# EAGLE design ZIntermediar2024 (EAGLE 6.5.0)
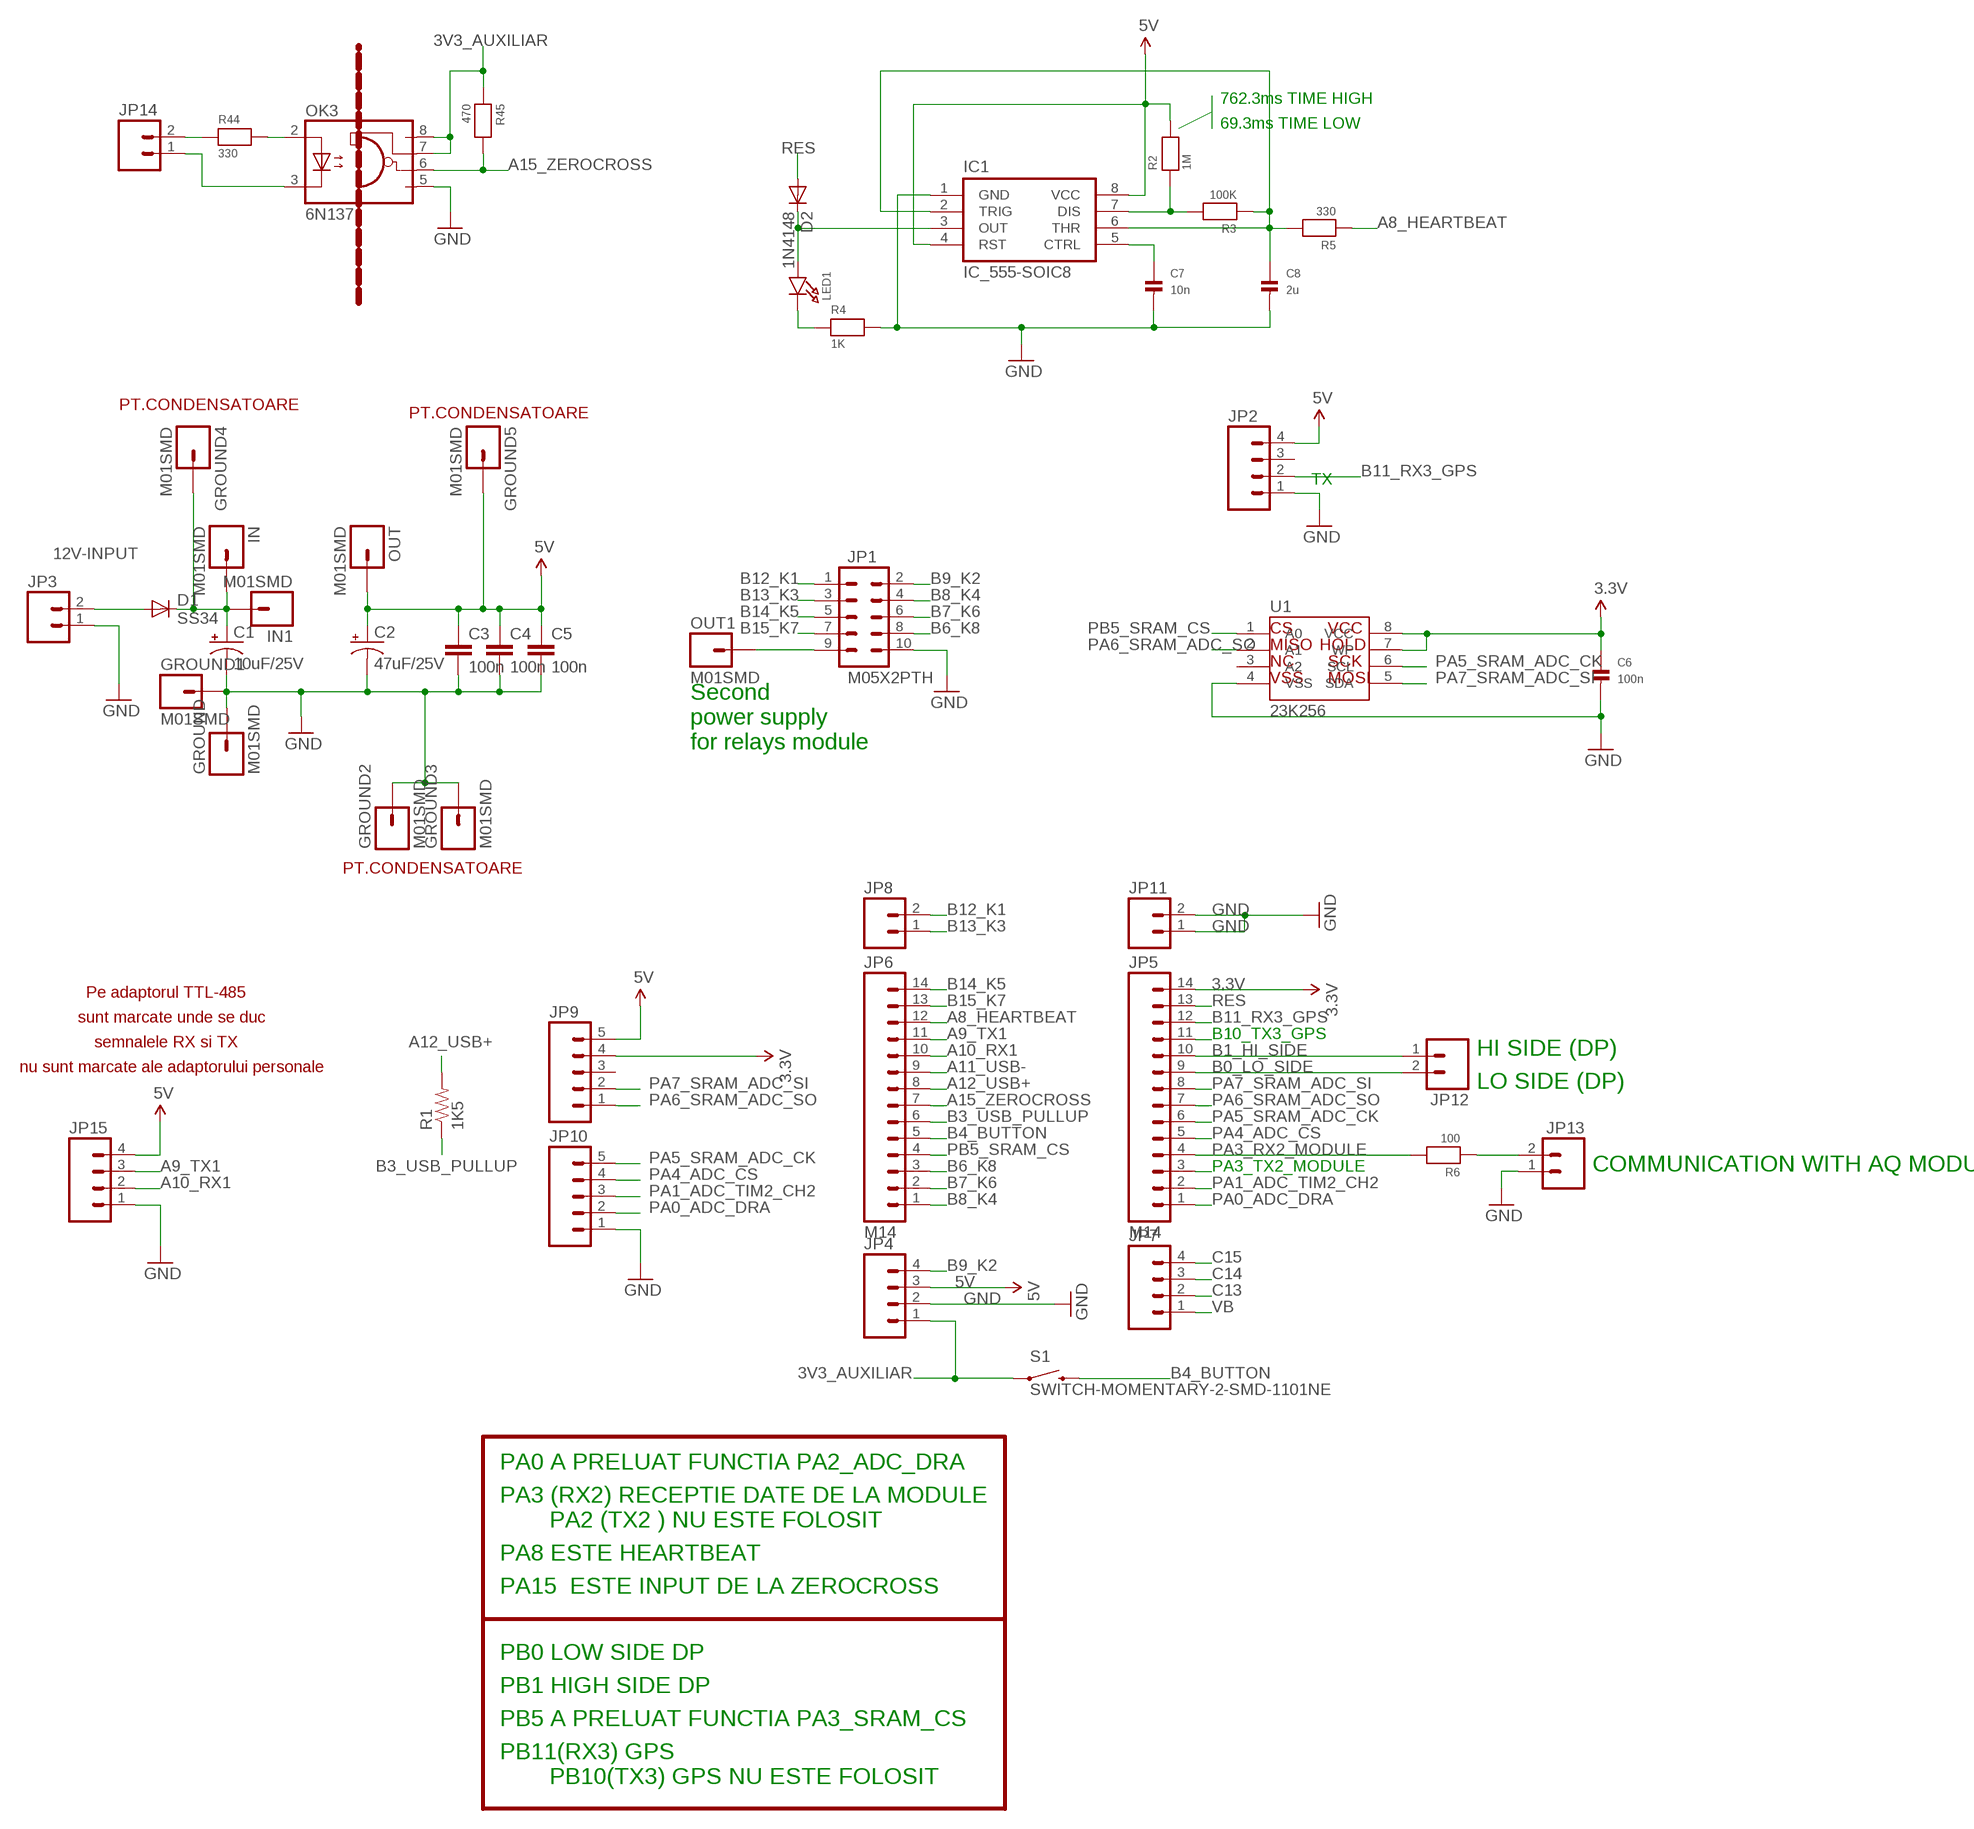
[diagram p0: schematic, sheet 1]

## Parts
C1  10uF/25V  CAP_POLE  [PANASONIC_E]
C2  47uF/25V  CAP_POLE  [PANASONIC_E]
C3  100n  CAP1206  [1206]
C4  100n  CAP1206  [1206]
C5  100n  CAP1206  [1206]
C6  100n  CAP_CERAMIC_0805MP  [_0805MP]
C7  10n  CAP_CERAMIC_0805MP  [_0805MP]
C8  2u  CAP_CERAMIC1206  [1206]
D1  SS34  DIODE-SMC  [SMC]
D2  1N4148  DIODE-MINIMELF  [MINIMELF]
GROUND  M01SMD  [LUXEON-PAD]
GROUND1  M01SMD  [LUXEON-PAD]
GROUND2  M01SMD  [LUXEON-PAD]
GROUND3  M01SMD  [LUXEON-PAD]
GROUND4  M01SMD  [LUXEON-PAD]
GROUND5  M01SMD  [LUXEON-PAD]
IC1  IC_555-SOIC8  [SOIC-8]
IN  M01SMD  [LUXEON-PAD]
IN1  M01SMD  [LUXEON-PAD]
JP1  M05X2PTH  [AVR_ICSP]
JP2  M04PTH  [1X04]
JP3  M025MM  [SCREWTERMINAL-5MM-2]
JP4  M04PTH  [1X04]
JP5  M14  [1X14]
JP6  M14  [1X14]
JP7  M04PTH  [1X04]
JP8  M02PTH  [1X02]
JP9  M05PTH_LONGPADS  [1X05_LONGPADS]
JP10  M05PTH_LONGPADS  [1X05_LONGPADS]
JP11  M02PTH  [1X02]
JP12  M025MM  [SCREWTERMINAL-5MM-2]
JP13  M025MM  [SCREWTERMINAL-5MM-2]
JP14  M025MM  [SCREWTERMINAL-5MM-2]
JP15  M04LONGPADS  [1X04_LONGPADS]
LED1  LED0805  [CHIPLED_0805]
OK3  6N137  [DIL08]
OUT  M01SMD  [LUXEON-PAD]
OUT1  M01SMD  [LUXEON-PAD]
R1  1K5  RESISTOR1206  [1206]
R2  1M  RESISTOR_0805MP  [_0805MP]
R3  100K  RESISTOR_0805MP  [_0805MP]
R4  1K  RESISTOR_0805MP  [_0805MP]
R5  330  RESISTOR_0805MP  [_0805MP]
R6  100  RESISTOR_0805MP  [_0805MP]
R44  330  RESISTOR_0805MP  [_0805MP]
R45  470  RESISTOR_0805MP  [_0805MP]
S1  SWITCH-MOMENTARY-2-SMD-1101NE  [TACTILE-SWITCH-1101NE]
U1  23K256  EEPROM-I2CSMD  [SO08]

## Nets
3.3V: C6.1 JP5.14 JP9.4 U1.7(WP) U1.8(VCC)
3V3_AUXILIAR: JP4.1 OK3.7(VE) OK3.8(VCC) R45.1 S1.P$1
5V: C2.+ C3.1 C4.1 C5.1 GROUND5.P$1 IC1.4(RST) IC1.8(VCC) JP2.4 JP4.3 JP9.5 JP15.4 OUT.P$1 R2.2
12V-INPUT: C1.+ D1.C GROUND4.P$1 IN1.P$1 IN.P$1
A8_HEARTBEAT: JP6.12 R5.1
A9_TX1: JP6.11 JP15.3
A10_RX1: JP6.10 JP15.2
A11_USB-: JP6.9
A12_USB+: JP6.8 R1.2
A15_ZEROCROSS: JP6.7 OK3.6(VO) R45.2
B0_LO_SIDE: JP5.9 JP12.2
B1_HI_SIDE: JP5.10 JP12.1
B3_USB_PULLUP: JP6.6 R1.1
B4_BUTTON: JP6.5 S1.P$2
B6_K8: JP1.8 JP6.3
B7_K6: JP1.6 JP6.2
B8_K4: JP1.4 JP6.1
B9_K2: JP1.2 JP4.4
B11_RX3_GPS: JP2.2 JP5.12
B12_K1: JP1.1 JP8.2
B13_K3: JP1.3 JP8.1
B14_K5: JP1.5 JP6.14
B15_K7: JP1.7 JP6.13
C13: JP7.2
C14: JP7.3
C15: JP7.4
CTRL: C7.1 IC1.5(CTRL)
GND: C1.- C2.- C3.2 C4.2 C5.2 C6.2 C7.2 C8.2 GROUND1.P$1 GROUND2.P$1 GROUND3.P$1 GROUND.P$1 IC1.1(GND) JP1.10 JP2.1 JP3.1 JP4.2 JP10.1 JP11.1 JP11.2 JP13.1 JP15.1 OK3.5(GND) R4.2 U1.4(VSS)
IMPULSE: JP14.2 R44.1
N$1: D2.C IC1.3(OUT) LED1.A
N$2: LED1.C R4.1
N$3: JP1.9 OUT1.P$1
N$4: JP14.1 OK3.3(C)
N$5: JP5.11
N$6: C8.1 IC1.2(TRIG) IC1.6(THR) R3.1 R5.2
N$7: D1.A JP3.2
N$8: IC1.7(DIS) R2.1 R3.2
N$10: JP5.3
N$12: JP13.2 R6.1
N$53: OK3.2(A) R44.2
PA0_ADC_DRA: JP5.1 JP10.2
PA1_ADC_TIM2_CH2: JP5.2 JP10.3
PA3_RX2_MODULE: JP5.4 R6.2
PA4_ADC_CS: JP5.5 JP10.4
PA5_SRAM_ADC_CK: JP5.6 JP10.5 U1.6(SCL)
PA6_SRAM_ADC_SO: JP5.7 JP9.1 U1.2(A1)
PA7_SRAM_ADC_SI: JP5.8 JP9.2 U1.5(SDA)
PB5_SRAM_CS: JP6.4 U1.1(A0)
RES: D2.A JP5.13
VB: JP7.1
Unconnected: JP2.3 JP9.3 U1.3(A2)

## Notes on the sheet
- 762.3ms TIME HIGH
- 69.3ms TIME LOW
- PT.CONDENSATOARE
- PT.CONDENSATOARE
- TX
- CS | VCC
- MISO | HOLD
- NC | SCK
- VSS | MOSI
- Second
- power supply
- for relays module
- PT.CONDENSATOARE
- Pe adaptorul TTL-485
- sunt marcate unde se duc
- B10_TX3_GPS
- semnalele RX si TX
- HI SIDE (DP)
- nu sunt marcate ale adaptorului personale
- LO SIDE (DP)
- PA3_TX2_MODULE | COMMUNICATION WITH AQ MODULE
- PA0 A PRELUAT FUNCTIA PA2_ADC_DRA
- PA3 (RX2) RECEPTIE DATE DE LA MODULE
- PA2 (TX2 ) NU ESTE FOLOSIT
- PA8 ESTE HEARTBEAT
- PA15  ESTE INPUT DE LA ZEROCROSS
- PB0 LOW SIDE DP
- PB1 HIGH SIDE DP
- PB5 A PRELUAT FUNCTIA PA3_SRAM_CS
- PB11(RX3) GPS
- PB10(TX3) GPS NU ESTE FOLOSIT

## Library data of the parts
C1 C2 = SparkFun-Passives:CAP_POL: Capacitor Polarized These are standard SMD and PTH capacitors. Normally 10uF, 47uF, and 100uF in electrolytic and tantalum varieties. Always verify the external diameter of the through hole cap, it varies with capacity, voltage, and manufacturer. The EIA devices should be standard.
C3-C5 = SparkFun-Passives:CAP: Capacitor Standard 0603 ceramic capacitor, and 0.1" leaded capacitor.
C6-C8 = microbuilder:CAP_CERAMIC: Ceramic Capacitors 0402 - 0402 Surface Mount Capacitors 16pF 50V 5% [Digikey: 445-4899-2-ND] 18pF 50V 5% [Digikey: 490-1281-2-ND] 22pF 50V 5% [Digikey: 490-1283-2-ND] 68pF 50V 5% [Digikey: 490-1289-2-ND] 0.1uF 10V 10% [Digikey: 490-1318-2-ND] 1.0uF 6.3V 10% [Digikey: 490-1320-2-ND] 0603 - 0603 Surface Mount Capacitors 16 pF 50V 5% [Digikey: 445-5051-2-ND] 22 pF 50V [Digikey: PCC220ACVTR-ND] 33 pF 50V 5% [Digikey: 490-1415-1-ND] 56pF 50V 5% [Digikey: 490-1421-1-ND] 220pF 50V 5% [Digikey: 445-1285-1-ND] 680 pF 50V 2200 pF 50V 5% C0G [Digikey: 445-1297-1-ND] 5600 pF 100V 5% X7R [Digikey: 478-3711-1-ND] 0.1 µF 25V 10% [Digikey: PCC2277TR-ND] 0.22 µF 16V 10% X7R [Digikey: 445-1318-1-ND] 1.0 µF 25V 10% [Digikey: 445-5146-2-ND] 0603 - RF Specific 3pF 250V +/-0.1pF RF [Digikey: 712-1347-1-ND] 18 pF 250V 5% [Digikey: 478-3505-1-ND or 712-1322-1-ND] 56 pF 250V 5% C0G RF [Digikey: 490-4867-1-ND] 68 pF 250V RF [Digikey: 490-4868-1-ND] 0805 - 0805 Surface Mount Capacitors 220 pF 250V 2% RF Ceramic Capacitor [Digikey: 712-1398-1-ND] 1000 pF 50V 2% NP0 Ceramic Capacitor [Digikey: 478-3760-1-ND] 0.1 µF 25V 10% Ceramic Capacitor [Digikey: PCC1828TR-ND] 1.0 µF 16V 10% Ceramic Capacitor[Digikey: 490-1691-2-ND] 10.0 µF 10V 10% Ceramic Capacitor[Digikey: 709-1228-1-ND] 10.0 uF 16V 10% Ceramic Capacitor [Digikey: 478-5165-2-ND] 47 uF 6.3V 20% Ceramic Capacitor [Digikey: 587-1779-1-ND or 399-5506-1-ND] 1206 - 1206 Surface Mount Capacitors 47uF 10V 20% Ceramic Capacitor [Digikey: 490-5528-1-ND or 399-5508-1-ND or 445-6010-1-ND] 100uF 6.3V -20%, +80% Y5V Ceramic Capacitor (Digikey: 490-4512-1-ND, Mouser: 81-GRM31CF50J107ZE1L)
D1 D2 = diode:DIODE-: DIODE
GROUND GROUND1-GROUND5 IN IN1 OUT OUT1 = SparkFun-Connectors:M01: Header 1 Standard 1-pin 0.1" header. Use with straight break away headers (SKU : PRT-00116), right angle break away headers (PRT-00553), swiss pins (PRT-00743), machine pins (PRT-00117), and female headers (PRT-00115).
IC1 = dp_devices:IC_555: Classic 555 IC
JP1 = SparkFun-Connectors:M05X2: Header 5x2 Standard 10-pin dual row 0.1" header. Commonly used with AVR-ISP. Use with Spark Fun Electronics SKU: PRT-00778
JP2 JP4 JP7 JP15 = SparkFun-Connectors:M04: Header 4 Standard 4-pin 0.1" header. Use with straight break away headers (SKU : PRT-00116), right angle break away headers (PRT-00553), swiss pins (PRT-00743), machine pins (PRT-00117), and female headers (PRT-00115). Molex polarized connector foot print use with SKU : PRT-08231 with associated crimp pins and housings. 1MM SMD Version SKU: PRT-10208
JP3 JP8 JP11-JP14 = SparkFun-Connectors:M02: Header 2 Standard 2-pin 0.1" header. Use with straight break away headers (SKU : PRT-00116), right angle break away headers (PRT-00553), swiss pins (PRT-00743), machine pins (PRT-00117), and female headers (PRT-00115). Molex polarized connector foot print use with SKU : PRT-08233 with associated crimp pins and housings.
JP5 JP6 = SparkFun-Connectors:M14: Header 14 Standard 14-pin 0.1" header. Use with straight break away headers (SKU : PRT-00116), right angle break away headers (PRT-00553), swiss pins (PRT-00743), machine pins (PRT-00117), and female headers (PRT-00115).
JP9 JP10 = SparkFun-Connectors:M05: Header 5 Standard 5-pin 0.1" header. Use with straight break away headers (SKU : PRT-00116), right angle break away headers (PRT-00553), swiss pins (PRT-00743), machine pins (PRT-00117), and female headers (PRT-00115). Molex polarized connector foot print use with SKU : PRT-08230 with associated crimp pins and housings.
LED1 = microbuilder:LED: LED 0603 - 0603 Surface Mount Package 2mA: Green LED - Low Power (3.9mcd, 2ma, 1.7Vf) - Digikey: 475-2709-2-ND Orange LED - Low Power (9.8mcd, 2ma, 1.8Vf) - Digikey: 475-1194-2-ND Red LED - Low Power (5mcd, 2ma, 1.8Vf) - Digikey: 475-1195-2-ND Yellow LED - Low Power (7mcd, 2ma, 1.8Vf) - Digikey: 475-1196-2-ND 5mA: Blue LED - Low Power (17mcd, 5ma, 2.9Vf) - Digikey: LNJ937W8CRACT-ND 0805 - 0805 Surface Mount Package 2mA: Red LED (8.8mcd, 2mA, 1.8Vf, Clear) - Low Power [Digikey: 475-2510-1-ND] Green LED (5mcd, 2mA, 1.8Vf, Clear) - Low Power [Digikey: 475-2730-1-ND] Yellow LED (11.3mcd, 2mA, 1.8Vf, Clear) - Low Power [Digikey: 475-2555-1-ND] 20mA: Red LED (104mcd, 20mA, Diffused) - LS R976 [Digikey: 475-1278-6-ND] Red LED (12mcd, 20mA, 2.0Vf, Clear) - APT2012EC [Digikey: 754-1128-1-ND] Green LED (15mcd, 20mA, 2.2Vf, Clear) - APT2012GC [Digikey: 754-1131-1-ND] Orange LED (160mcd, 20mA, 2.1Vf, Clear) - APT2012SECK [Digikey: 754-1130-1-ND] 1206 - 1206 Surface Mount Package Green LED (26mcd, 20mA, Diffused) - LG N971 [Digikey: 475-1407-6-ND] Red LED (15mcd, 20mA, Diffused) - LH N974 [Digikey: 475-1416-6-ND] Cree - Cree High-Power Surface Mount LEDs XPEBWT-L1-0000-00D50 - White 111lm 350mA 2.9Vf 6200K 110° XTEAWT-00-0000-00000LEE3 - White 114lm 350mA 2.85Vf 5000K 115° Everlight - Everlight 45-21 Series Surface Mount LEDs 45-21/QK2C-B2832AC2CB2/2T - Warm White 2000mcd 20mA 3.25Vf 3050K 120° 45-21/LK2C-B38452C4CB2/2T - Nuetral White 2000mcd 20mA 3.25Vf 4150K 120° 45-21/LK2C-B50634C6CB2/2T - Cold White 2200mcd 20mA 3.25Vf 5650K 120° PLCC2 Reverse Mount LS T77K-J1L2-1-0-2-R18-Z - Red 11.25mcd 2mA 1.8Vf 630nm 120° LO T77K-L1M2-24-Z - Orange 19.6mcd 2mA 1.8Vf 606nm 120° LY T77K-K2M1-26-Z - Yellow 15.7mcd 2mA 1.8Vf 587nm 120°
OK3 = optocoupler:6N137: MOTOROLA OPTO COUPLER; MPN: 6N137; OC_FARNELL: 1328376; OC_NEWARK: 52M1895
R1 = SparkFun-Passives:RESISTOR: Resistor Basic schematic elements and footprints for 0603, 1206, and PTH resistors.
R2-R6 R44 R45 = microbuilder:RESISTOR: Resistors 0402 - 0402 Surface Mount Package 22 Ohm 1% 1/16W [Digikey: 311-22.0LRTR-ND] 33 Ohm 5% 1/16W 1.0K 5% 1/16W 1.5K 5% 1/16W 2.0K 1% 1/16W 10.0K 1% 1/16W [Digikey: 311-10.0KLRTR-ND] 10.0K 5% 1/16W [Digikey: RMCF0402JT10K0TR-ND] 12.1K 1% 1/16W [Digikey: 311-22.0LRTR-ND] 100.0K 5% 1/16W 0603 - 0603 Surface Mount Package 0 Ohm 1/10 Watt 1% Resistor 15 Ohm 1/10 Watt 1% Resistor 33 Ohm 1/10 Watt 1% Resistor 49.9 Ohm 1/10 Watt 1% Resistor 100 Ohm 1/10 Watt 1% Resistor 150 Ohm 1/10 Watt 1% Resistor 240 Ohm 1/10 Watt 1% Resistor 390 Ohm 1/10 Watt 1% Resistor 560 Ohm 1/10 Watt 1% Resistor 680 Ohm 1/10 Watt 1% Resistor 750 Ohm 1/10 Watt 1% Resistor 1.0K Ohm 1/10 Watt 1% Resistor 1.5K Ohm 1/10 Watt 1% Resistor 2.0K Ohm 1/10 Watt 1% Resistor 2.2K Ohm 1/10 Watt 1% Resistor 3.3K Ohm 1/10 Watt 1% Resistor 4.7K Ohm 1/10 Watt 1% Resistor 10.0K Ohm 1/10 Watt 1% Resistor 12.0K Ohm 1/10 Watt 1% Resistor 12.1K Ohm 1/10 Watt 1% Resistor 20.0K Ohm 1/10 Watt 1% Resistor 33.0K Ohm 1/10 Watt 1% Resistor 100.0K Ohm 1/10 Watt 1% Resistor 0805 - 0805 Surface Mount Package 0 Ohm 1/8 Watt 1% Resistor 33 Ohm 1/8 Watt 1% Resistor 100 Ohm 1/8 Watt 1% Resistor 150 Ohm 1/8 Watt 1% Resistor 200 Ohm 1/8 Watt 1% Resistor 240 Ohm 1/8 Watt 1% Resistor 330 Ohm 1/8 Watt 1% Resistor 390 Ohm 1/8 Watt 1% Resistor 470 Ohm 1/8 Watt 1% Resistor 1.0K Ohm 1/8 Watt 1% Resistor 1.5K Ohm 1/8 Watt 1% Resistor 2.0K Ohm 1/8 Watt 1% Resistor 4.7K Ohm 1/8 Watt 1% Resistor 5.1K Ohm 1/8 Watt 1% Resistor 5.6K Ohm 1/8 Watt 1% Resistor 10.0K Ohm 1/8 Watt 1% Resistor 22.0K Ohm 1/8 Watt 1% Resistor 33.0K Ohm 1/8 Watt 1% Resistor 100K Ohm 1/8 Watt 1% Resistor 1206 - 1206 Surface Mount Package 2012 - 2010 Surface Mount Package 0.11 Ohm 1/2 Watt 1% Resistor - Digikey: RHM.11UCT-ND
S1 = SparkFun-Electromechanical:SWITCH-MOMENTARY-2: Various NO switches- pushbuttons, reed, etc
U1 = SparkFun-DigitalIC:EEPROM-I2C: I2C EEPROM chips, 24LC256 (and others)

## Board
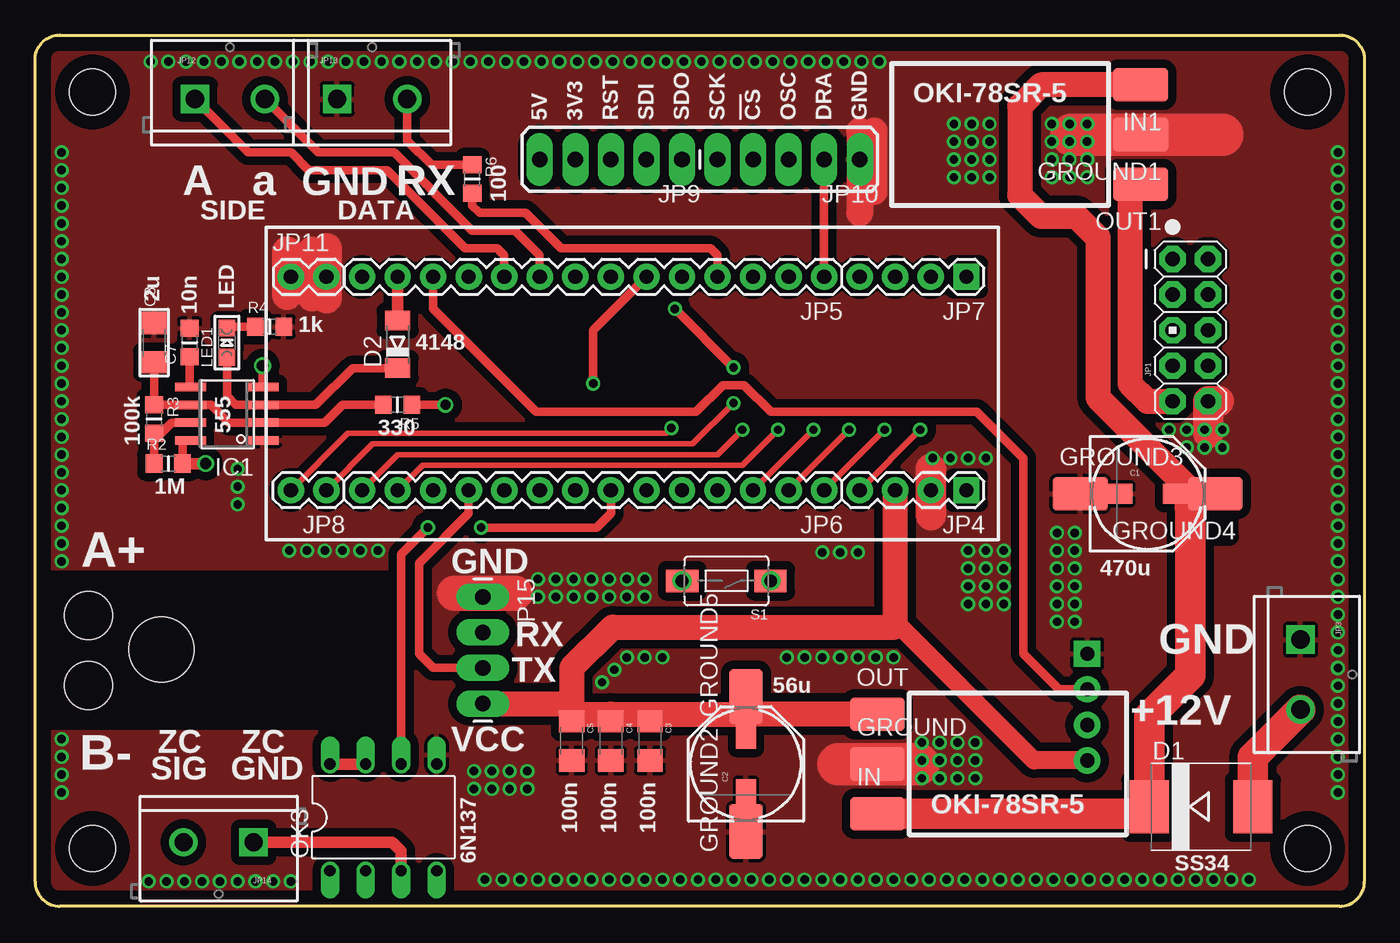
[diagram p1: board, top side]
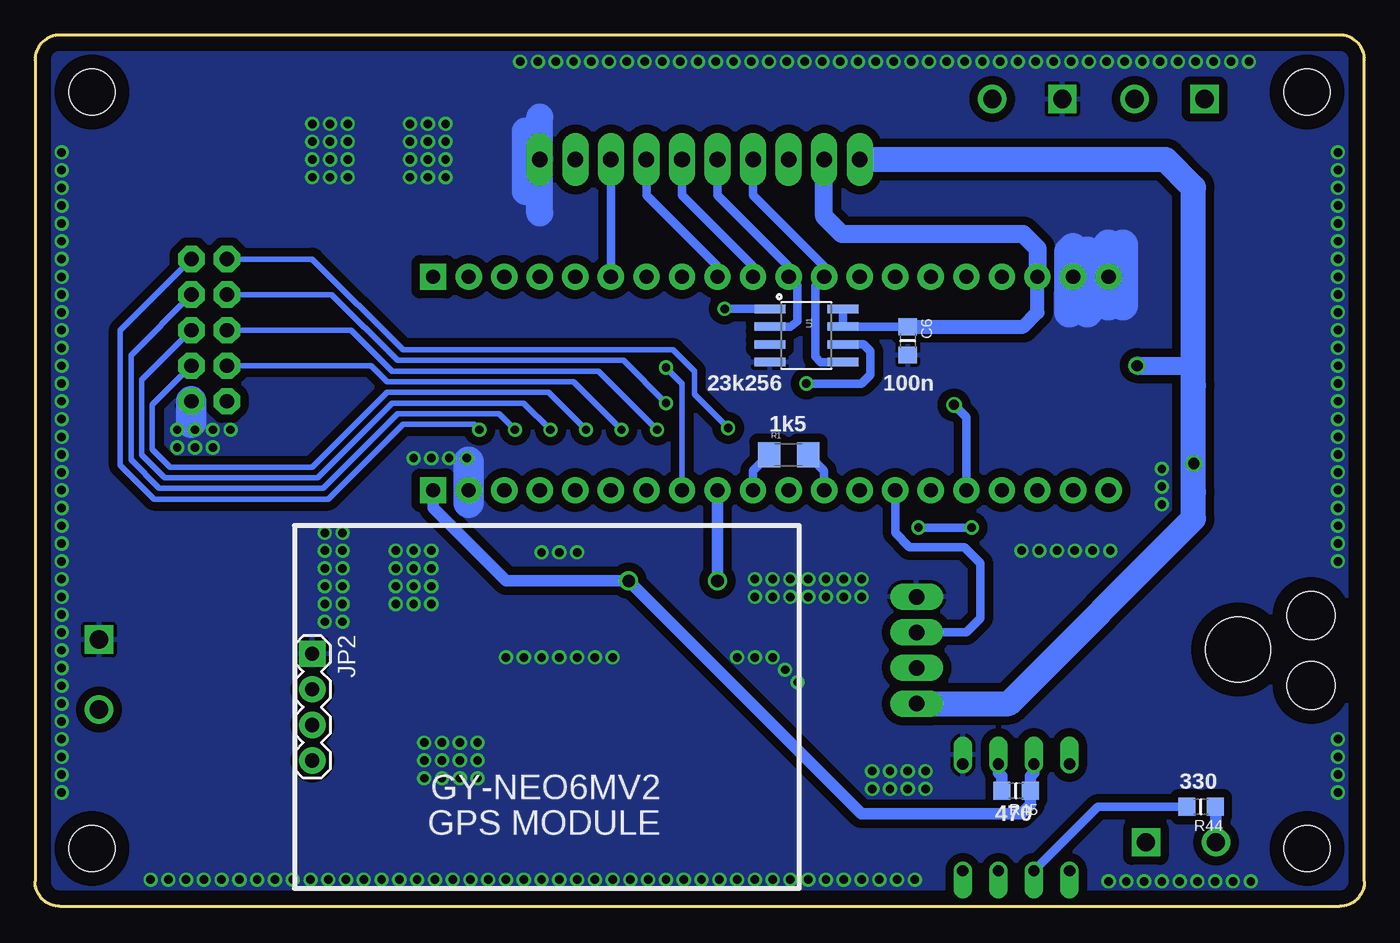
[diagram p2: board, bottom side, seen from below]

Size 95 x 62.23 mm. Coordinates in mm from the lower left corner, seen from the top.
Outline: 0,1.78 0,60.45 arc-90 1.78,62.23 93.22,62.23 arc-90 95,60.45 95,1.78 arc-90 93.22,0 1.78,0 arc-90 0,1.78
Copper layers (1*16): Top 0.035mm / dielectric 1.5mm / Bottom 0.035mm
Design rules "default *": minimum track width 10mil, minimum drill 24mil, track to track 8mil, track to pad 8mil, pad to pad 8mil, via to via 8mil, smd to smd 8mil, copper to edge 40mil, drill to drill 8mil, minimum pad ring 10mil, minimum via ring 8mil, stop-mask expansion 4mil, vias tented up to drill 24mil, thermal gap 10mil
Holes 3.43 mm at 3.84,20.78 3.84,15.77
Holes 4.65 mm at 9.04,18.34
tRestrict: area 84.4,26.4 to 85.4,27.7; area 0.9,13.2 to 26.3,23.4

### Footprints (pad centres in the part's own frame; a part is rotated, then mirrored left to right if it is on the bottom)
PANASONIC_E = smd 3.8 x 1.4: + 3,0; - -3,0
1206 = smd 1.6 x 1.8: 1 -1.4,0; 2 1.4,0
_0805MP = smd 1.2 x 1.3: 1 -1.016,0; 2 1.016,0
SMC = smd 2.8 x 3.8: A 3.7,0; C -3.7,0
MINIMELF = smd 1.4 x 1.8: A 1.7,0; C -1.7,0
LUXEON-PAD = smd 3.9 x 2.4: P$1 0,0
SOIC-8 = smd 0.6 x 2.2: 1 -1.905,-2.6; 2 -0.635,-2.6; 3 0.635,-2.6; 4 1.905,-2.6; 5 1.905,2.6; 6 0.635,2.6; 7 -0.635,2.6; 8 -1.905,2.6
AVR_ICSP = drill 1.016 pad 1.88 octagon: 1 -1.27,5.08; 2 1.27,5.08; 3 -1.27,2.54; 4 1.27,2.54; 5 -1.27,0; 6 1.27,0; 7 -1.27,-2.54; 8 1.27,-2.54; 9 -1.27,-5.08; 10 1.27,-5.08
1X04 = drill 1.016 pad 1.88 square: 1 0,0 | drill 1.016 pad 1.88: 2 2.54,0; 3 5.08,0; 4 7.62,0
SCREWTERMINAL-5MM-2 = drill 1.3 pad 2.032 square: 1 0,0 | drill 1.3 pad 2.032: 2 5,0
1X14 = drill 1.016 pad 1.88: 1 0,0; 2 2.54,0; 3 5.08,0; 4 7.62,0; 5 10.16,0; 6 12.7,0; 7 15.24,0; 8 17.78,0; 9 20.32,0; 10 22.86,0; 11 25.4,0; 12 27.94,0; 13 30.48,0; 14 33.02,0
1X02 = drill 1.016 pad 1.88: 1 0,0; 2 2.54,0
1X05_LONGPADS = drill 1.118 pad 1.88 long: 1 0,0; 2 2.54,0; 3 5.08,0; 4 7.62,0; 5 10.16,0
1X04_LONGPADS = drill 1.118 pad 1.88 long: 1 0,0; 2 2.54,0; 3 5.08,0; 4 7.62,0
CHIPLED_0805 = smd 1.2 x 1.2: A 0,-1.05; C 0,1.05
DIL08 = drill 0.813 offset: 1 -3.81,-3.81; 2 -1.27,-3.81; 3 1.27,-3.81; 4 3.81,-3.81; 5 3.81,3.81; 6 1.27,3.81; 7 -1.27,3.81; 8 -3.81,3.81
TACTILE-SWITCH-1101NE = smd 2.3 x 1.6: P$1 -3.15,0; P$2 3.15,0
STAND-OFF = hole 3.302: 0,0
SO08 = smd 0.61 x 2.21: 1 -1.905,-2.616; 2 -0.635,-2.616; 3 0.635,-2.616; 4 1.905,-2.616; 5 1.905,2.616; 6 0.635,2.616; 7 -0.635,2.616; 8 -1.905,2.616

### Placement (x,y rotation side)
C1  79.5,29.46 0 top
C2  50.8,10.16 90 top
C3  43.94,11.81 270 top
C4  41.15,11.81 270 top
C5  38.35,11.81 270 top
C6  32.64,40.39 270 bottom
C7  11.05,40.26 90 top
C8  8.51,40.26 90 top
D1  83.31,7.11 0 top
D2  25.91,40.13 90 top
GROUND  60.2,10.16 0 top
GROUND1  78.99,55.12 180 top
GROUND2  50.8,5.33 90 top
GROUND3  74.68,29.46 0 top
GROUND4  84.33,29.46 180 top
GROUND5  50.8,14.99 90 top
IC1  13.72,35.18 90 top
IN  60.2,6.6 0 top
IN1  78.99,58.67 180 top
JP1  82.55,41.15 0 top
JP2  75.18,18.03 270 bottom
JP3  90.42,19.05 270 top
JP4  66.55,29.72 180 top
JP5  56.39,44.96 180 top
JP6  56.39,29.72 180 top
JP7  66.55,44.96 180 top
JP8  20.83,29.72 180 top
JP9  46.23,53.34 180 top
JP10  58.93,53.34 180 top
JP11  18.29,44.96 0 top
JP12  11.43,57.66 0 top
JP13  21.59,57.66 0 top
JP14  15.62,4.57 180 top
JP15  32,22.1 270 top
LED1  13.72,40.26 0 top
OK3  24.89,6.35 0 top
OUT  60.2,13.72 0 top
OUT1  78.99,51.56 180 top
R1  41.15,32.26 0 bottom
R2  9.53,31.62 0 top
R3  8.51,34.8 270 top
R4  16.76,41.4 0 top
R5  25.91,35.81 180 top
R6  31.24,51.94 270 top
R44  11.68,7.11 180 bottom
R45  24.89,8.26 180 bottom
S1  49.4,23.24 180 top
STANDOFF1  STAND-OFF  [STAND-OFF]  90.93,4.11 0 top
STANDOFF6  STAND-OFF  [STAND-OFF]  4.11,58.17 0 top
STANDOFF10  STAND-OFF  [STAND-OFF]  90.93,58.17 0 top
STANDOFF12  STAND-OFF  [STAND-OFF]  4.11,4.11 0 top
U1  39.88,40.77 270 bottom

### Tracks (layer width: path | path; a pad name or v marks a point on that pad's centre or on a via)
3.3V
  Bottom 0.61: U1.8 U1.7 C6.1
  Bottom 1.016: C6.1 24.38,41.41 23.37,42.42 JP5.14
  Bottom 1.27: JP9.4 38.61,49.28 37.34,48.01 24.38,48.01 23.37,46.99 JP5.14
3V3_AUXILIAR  (via drill 0.9)
  Top 0.813: v52.58,23.24 S1.P$1 | OK3.8 OK3.7
  Bottom 0.813: JP4.1 66.55,28.45 61.34,23.24 v52.58,23.24 35.94,6.6 24.51,6.6 23.88,7.24 R45.1 23.88,9.27 23.62,9.53 OK3.7
5V  (via drill 0.8)
  Top 0.406: GROUND5.P$1 50.8,13.72 C2.+
  Top 0.61: IC1.8 10.54,33.27 R2.2 | IC1.4 16.26,37.08 v16.26,38.61 | C5.1 38.35,13.46 38.61,13.72 | 41.15,13.72 C4.1 C3.1 | 38.1,14.48 38.1,14.22 38.48,13.84
  Top 0.813: R2.2 v12.19,31.62
  Top 1.27: JP2.4 71.37,10.41 61.47,20.32
  Top 1.778: OUT.P$1 50.8,13.72 41.15,13.72 38.61,13.72 38.48,13.84 38.35,13.97 38.35,17.02 41.28,19.94 61.47,19.94 61.47,20.32 JP4.3 | JP15.4 38.1,14.48
  Bottom 1.27: JP9.5 35.81,53.34 | v12.19,31.62 12.22,29.59 | v16.26,38.61 12.34,38.61 12.22,37.21
  Bottom 1.778: JP15.4 25.43,14.48 12.22,27.69 12.22,29.59 12.22,37.21 12.22,51.33 14.22,53.34 35.81,53.34
12V-INPUT
  Top 0.406: C1.+ GROUND4.P$1
  Top 0.61: 82.5,26.72 C1.+
  Top 1.778: IN1.P$1 71.88,58.67 70.36,57.15 70.36,50.8 71.88,49.28 74.42,49.28 75.95,47.75 75.95,36.32 82.5,29.77 C1.+
  Top 2.184: C1.+ 82.55,27.05 82.55,16.51 79.61,13.57 D1.C 79.61,6.75 79.76,6.6 IN.P$1
A8_HEARTBEAT  (via drill 0.7)
  Top 0.61: v29.34,35.81 R5.1
  Bottom 0.61: JP6.12 28.45,34.92 v29.34,35.81
A9_TX1
  Top 0.61: JP6.11 30.99,28.07 27.43,24.51 27.43,18.03 28.45,17.02 JP15.3
A10_RX1
  Bottom 0.61: JP6.10 33.53,26.67 32.51,25.65 28.58,25.65 27.43,24.51 27.43,20.57 28.45,19.56 JP15.2
A12_USB+
  Bottom 0.61: R1.2 38.61,31.12 JP6.8
A15_ZEROCROSS  (via drill 0.6)
  Top 0.61: JP6.7 41.15,28.07 40.13,27.05 v31.88,27.05 | v28.07,27.05 26.16,25.15 OK3.6
  Bottom 0.61: v31.88,27.05 v28.07,27.05
  Bottom 0.813: OK3.6 26.16,9.53 25.91,9.27 R45.2
B0_LO_SIDE
  Top 0.61: JP5.9 36.07,46.48 34.29,48.26 31.24,48.26 25.65,53.85 20.24,53.85 JP12.2
B1_HI_SIDE
  Top 0.61: JP5.10 33.53,46.48 33.02,46.99 30.73,46.99 25.15,52.58 19.56,52.58 18.29,53.85 15.24,53.85 JP12.1
B3_USB_PULLUP
  Bottom 0.61: R1.1 43.69,31.12 JP6.6
B4_BUTTON  (via drill 0.9)
  Top 0.813: v46.23,23.24 46.23,23.27 S1.P$2
  Bottom 0.813: JP6.5 v46.23,23.24
B6_K8  (via drill 0.6)
  Top 0.406: JP6.3 v55.63,34.04
  Bottom 0.406: JP1.8 86.61,35.81 86.61,32.64 85.34,31.37 75.18,31.37 69.85,36.7 58.29,36.7 v55.63,34.04
B7_K6  (via drill 0.6)
  Top 0.406: JP6.2 v58.17,34.04
  Bottom 0.406: JP1.6 87.38,37.59 87.38,32.26 85.72,30.61 74.8,30.61 69.47,35.94 60.07,35.94 v58.17,34.04
B8_K4  (via drill 0.6)
  Top 0.406: JP6.1 v60.71,34.04
  Bottom 0.406: v60.71,34.04 61.85,35.18 69.09,35.18 74.42,29.84 86.11,29.84 88.14,31.88 88.14,39.37 JP1.4
B9_K2  (via drill 0.6)
  Top 0.406: JP4.4 v63.25,34.04
  Bottom 0.406: v63.25,34.04 63.63,34.42 68.71,34.42 74.04,29.08 86.49,29.08 88.9,31.5 88.9,41.15 JP1.2
B11_RX3_GPS
  Top 0.61: JP5.12 28.45,42.67 35.81,35.31 47.24,35.31 49.15,37.21 50.67,37.21 52.58,35.31 67.31,35.31 70.61,32 70.61,18.03 73.15,15.49 JP2.2
B12_K1  (via drill 0.6)
  Top 0.406: JP8.2 22.35,33.78 45.09,33.78 v45.47,34.16
  Bottom 0.406: JP1.1 75.18,46.23 68.71,39.75 49.4,39.75 47.88,38.23 47.88,36.58 v45.47,34.16
B13_K3  (via drill 0.6)
  Top 0.406: JP8.1 24.13,33.02 46.99,33.02 v49.91,35.94
  Bottom 0.406: JP1.3 73.79,43.69 69.09,38.99 52.96,38.99 v49.91,35.94
B14_K5  (via drill 0.6)
  Top 0.406: JP6.14 25.91,32.26 48.77,32.26 v50.55,34.04
  Bottom 0.406: JP1.5 72.39,41.15 69.47,38.23 54.74,38.23 v50.55,34.04
B15_K7  (via drill 0.6)
  Top 0.406: JP6.13 27.69,31.5 50.55,31.5 v53.09,34.04
  Bottom 0.406: JP1.7 70.99,38.61 69.85,37.47 56.52,37.47 v53.09,34.04
CTRL
  Top 0.61: IC1.5 11.05,37.08 C7.1
GND  (via drill 0.6)
  Top 0.406: 79.38,55.37 80.01,54.74 81.03,54.74 80.65,54.36 80.65,54.1 81.15,54.1 81.41,54.36 80.9,54.36 81.03,54.48 81.15,54.48
  Top 0.61: 29.97,22.35 30.23,22.1 JP15.1
  Top 1.93: 58.93,55.37 58.93,49.53 | 59.94,51.05 59.94,55.37
  Top 2.184: 84.58,36.07 JP1.10 83.82,33.78 | 64.01,27.94 64.01,31.24 | 18.03,43.69 18.03,46.74 | 19.81,43.56 19.81,46.74 | 20.83,43.43 20.83,46.99
  Top 2.54: 29.97,22.35 34.29,22.35
  Top 3.048: 63.12,10.16 57.4,10.16 | 74.04,55.12 84.84,55.12
  Bottom 1.93: 59.94,51.05 59.94,55.37 | 58.93,49.53 58.93,56.39
  Bottom 2.184: 83.82,34.54 JP1.10 | 18.29,47.24 18.29,42.93 | 20.83,46.99 20.83,42.67 | 19.81,46.74 19.81,42.42 | 21.08,46.74 21.08,42.42 | 17.27,47.24 17.27,42.93 | 64.01,31.75 64.01,28.83
  other vias: 10.8,60.33 8.26,60.33 12.07,60.33 20.96,60.33 1.91,53.85 22.23,60.33 9.53,60.33 23.5,60.33 75.18,55.88 73.91,55.88 72.64,55.88 72.64,54.61 73.91,54.61 75.18,54.61 75.18,53.34 73.91,53.34 72.64,53.34 72.64,52.07 73.91,52.07 75.18,52.07 81.03,34.04 82.3,34.04 83.57,34.04 82.3,32.77 83.57,32.77 84.84,34.04 84.84,32.77 24.77,60.33 26.04,60.33 80.39,1.91 81.66,1.91 82.93,1.91 84.2,1.91 85.47,1.91 86.74,1.91 1.91,11.94 1.91,24.64 1.91,25.91 1.91,27.18 1.91,28.45 1.91,10.67 1.91,9.4 1.91,8.13 11.94,1.78 10.67,1.78 31.37,8.38 31.37,9.65 32.64,9.65 35.18,8.38 32.13,1.91 14.61,60.33 17.15,60.33 19.69,60.33 18.42,60.33 13.34,60.33 15.88,60.33 9.4,1.78 8.13,1.78 70.23,1.91 68.96,1.91 67.69,1.91 66.42,1.91 65.15,1.91 63.88,1.91 79.12,1.91 77.85,1.91 76.58,1.91 75.31,1.91 74.04,1.91 72.77,1.91 71.5,1.91 1.91,39.88 1.91,36.07 1.91,32.26 1.91,30.99 1.91,34.8 1.91,38.61 1.91,37.34 1.91,33.53 1.91,29.72 33.91,9.65 44.83,1.91 35.94,1.91 51.18,1.91 52.45,1.91 62.61,1.91 53.72,1.91 33.91,8.38 32.64,8.38 43.56,1.91 34.67,1.91 56.26,1.91 57.53,1.91 58.8,1.91 60.07,1.91 61.34,1.91 49.91,1.91 48.64,1.91 47.37,1.91 46.1,1.91 54.99,1.91 33.4,1.91 42.29,1.91 39.75,1.91 41.02,1.91 38.48,1.91 37.21,1.91 35.18,9.65 1.91,52.58 1.91,51.31 1.91,50.04 1.91,48.77 1.91,47.5 1.91,41.15 1.91,42.42 1.91,43.69 1.91,44.96 1.91,46.23 28.58,60.33 29.85,60.33 31.12,60.33 32.39,60.33 33.66,60.33 27.3,60.33 68.2,55.88 66.93,55.88 65.66,55.88 65.66,54.61 66.93,54.61 68.2,54.61 68.2,53.34 66.93,53.34 65.66,53.34 65.66,52.07 66.93,52.07 68.2,52.07 55.25,60.33 53.98,60.33 56.52,60.33 57.78,60.33 59.06,60.33 60.33,60.33 93.09,23.37 66.67,24.13 67.94,21.59 66.67,22.86 69.22,22.86 93.09,27.18 93.09,24.64 93.09,30.99 74.3,24.13 64.14,32 65.41,32 74.3,26.67 73.03,24.13 74.3,25.4 73.03,26.67 66.67,32 66.67,21.59 67.94,22.86 69.22,21.59 66.67,25.4 67.94,25.4 69.22,24.13 67.94,32 73.03,25.4 67.94,24.13 69.22,25.4 93.09,32.26 93.09,25.91 93.09,33.53 93.09,37.34 93.09,38.61 93.09,41.15 93.09,28.45 93.09,34.8 93.09,36.07 93.09,39.88 93.09,29.72 58.8,25.27 57.53,25.27 56.26,25.27 13.21,1.78 14.48,1.78 15.75,1.78 17.02,1.78 18.29,1.78 42.29,17.78 41.4,16.89 40.51,16 43.56,17.78 44.83,17.78 61.34,17.78 60.07,17.78 58.8,17.78 57.53,17.78 56.26,17.78 54.99,17.78 53.72,17.78 43.56,22.1 42.29,22.1 41.02,22.1 39.75,22.1 38.48,22.1 37.21,22.1 35.94,22.1 35.94,23.37 37.21,23.37 38.48,23.37 39.75,23.37 41.02,23.37 42.29,23.37 43.56,23.37 24.51,25.4 23.24,25.4 21.97,25.4 20.7,25.4 19.43,25.4 18.16,25.4 14.48,28.7 14.48,29.97 14.48,31.24 73.03,22.86 74.3,22.86 74.3,21.59 73.03,21.59 73.03,20.32 74.3,20.32 93.09,42.42 93.09,43.69 93.09,44.96 93.09,46.23 93.09,47.5 93.09,48.77 93.09,50.04 93.09,51.31 93.09,52.58 93.09,53.85 34.93,60.33 36.2,60.33 37.47,60.33 38.73,60.33 40.01,60.33 41.28,60.33 42.55,60.33 43.81,60.33 45.09,60.33 46.36,60.33 47.62,60.33 48.9,60.33 50.17,60.33 51.44,60.33 52.7,60.33 93.09,22.1 93.09,20.83 93.09,19.56 93.09,18.29 93.09,17.02 93.09,15.75 93.09,14.48 93.09,13.21 93.09,11.94 93.09,10.67 93.09,9.4 93.09,8.13 64.64,9.14 67.18,10.41 65.91,9.14 65.91,11.68 67.18,9.14 65.91,10.41 67.18,11.68 63.37,9.14 63.37,10.41 64.64,11.68 64.64,10.41 63.37,11.68
  pour Bottom (isolate 0.61): 0,0 95,0 95,62.23 0,62.23
  pour Top (isolate 0.61): 0,62.23 95,62.23 95,0 0,0
IMPULSE
  Bottom 0.61: R44.1 10.62,7.11
  Bottom 0.813: 10.62,7.11 JP14.2
N$1
  Top 0.61: LED1.A 13.72,36.45 14.35,35.81 IC1.3 20.07,35.81 22.68,38.43 D2.C
N$2
  Top 0.61: R4.1 13.72,41.4 LED1.C
N$3
  Top 0.61: OUT1.P$1 78.23,51.56
  Top 1.778: 78.23,51.56 78.23,37.34 79.5,36.07 JP1.9
N$4
  Top 0.813: OK3.3 26.16,3.94 25.53,4.57 JP14.1
N$6
  Top 0.61: R5.2 21.97,35.81 20.7,34.54 IC1.2 13.84,34.54 12.57,35.81 IC1.6 R3.1 C8.1
N$7
  Top 2.184: JP3.2 87.01,10.64 D1.A
N$8
  Top 0.61: IC1.7 9.78,34.54 9.02,33.78 R3.2 R2.1
N$12
  Top 0.61: R6.1 28.32,52.96 26.59,54.69 JP13.2
N$53
  Bottom 0.61: R44.2 19.05,7.11 OK3.2
PA0_ADC_DRA
  Top 0.61: JP10.2 JP5.1
PA1_ADC_TIM2_CH2
  Bottom 0.61: JP5.2 JP10.3
PA3_RX2_MODULE
  Top 0.61: JP5.4 48.77,46.48 48.26,46.99 37.59,46.99 35.05,49.53 31.75,49.53 31.24,50.04 R6.2
PA4_ADC_CS
  Bottom 0.61: JP5.5 46.23,45.72 51.31,50.8 JP10.4
PA5_SRAM_ADC_CK  (via drill 0.6)
  Top 0.61: v39.88,37.34 39.88,41.15 JP5.6
  Bottom 0.61: JP5.6 43.69,45.72 48.77,50.8 JP10.5 | U1.6 35.81,40.13 35.31,39.62 35.31,37.97 35.94,37.34 v39.88,37.34
PA6_SRAM_ADC_SO
  Bottom 0.61: JP9.1 46.23,50.8 41.15,45.72 JP5.7 40.51,44.32 40.51,41.78 41.02,41.4 U1.2
PA7_SRAM_ADC_SI
  Bottom 0.406: 37.34,38.86 U1.5
  Bottom 0.61: JP9.2 43.69,50.8 38.61,45.72 JP5.8 39.24,44.32 39.24,39.24 38.86,38.86 U1.5
PB5_SRAM_CS  (via drill 0.6)
  Top 0.61: v49.91,38.48 v45.72,42.67
  Bottom 0.406: JP6.4 48.77,37.34 v49.91,38.48
  Bottom 0.61: U1.1 v45.72,42.67
RES
  Top 0.813: JP5.13 D2.A

### Text on the board
tPlace: OKI-78SR-5 | 5V | 3V3 | RST | SDI | SDO | SCK | CS | OSC | DRA | GND | A | a | GND | RX | 100 | SIDE | DATA | 2u | LED | 10n | 1k | 4148 | 555 | 330 | 100k | 1M | A+ | GND | 470u | RX | GND | TX | 56u | +12V | ZC | ZC | VCC | B- | SIG | GND | OKI-78SR-5 | 100n | 100n | 100n | 6N137 | SS34
bPlace: 100n | 23k256 | 1k5 | GY-NEO6MV2 | 330 | GPS MODULE | 470